# EAGLE schematic Rev2 (EAGLE 7.7.0)
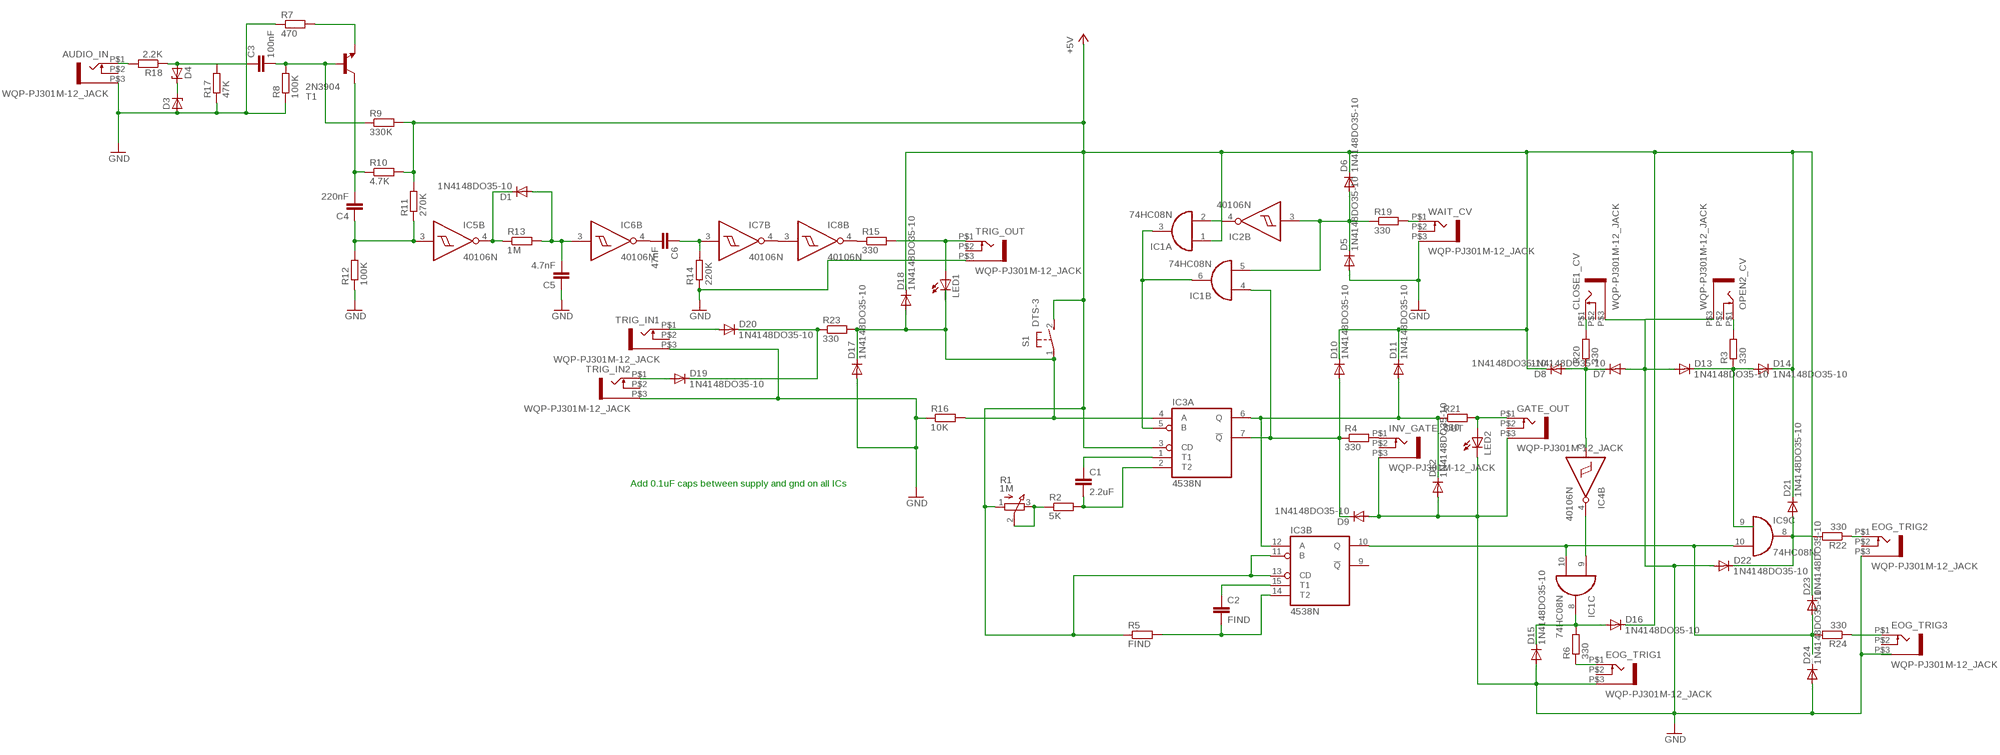
[diagram p0: schematic, sheet 1]

## Parts
AUDIO_IN  WQP-PJ301M-12_JACK  [WQP-PJ301M-12_JACK]
C1  2.2uF  C2,5-3  [C2.5-3]
C2  FIND  C2,5-3  [C2.5-3]
C3  100nF  C2,5-3  [C2.5-3]
C4  220nF  C2,5-3  [C2.5-3]
C5  4.7nF  C2,5-3  [C2.5-3]
C6  47nF  C2,5-3  [C2.5-3]
CLOSE1_CV  WQP-PJ301M-12_JACK  [WQP-PJ301M-12_JACK]
D1  1N4148DO35-10  [DO35-10]
D3  ZENER-DIODEC1702-15  [C1702-15]
D4  ZENER-DIODEC1702-15  [C1702-15]
D5  1N4148DO35-10  [DO35-10]
D6  1N4148DO35-10  [DO35-10]
D7  1N4148DO35-10  [DO35-10]
D8  1N4148DO35-10  [DO35-10]
D9  1N4148DO35-10  [DO35-10]
D10  1N4148DO35-10  [DO35-10]
D11  1N4148DO35-10  [DO35-10]
D12  1N4148DO35-10  [DO35-10]
D13  1N4148DO35-10  [DO35-10]
D14  1N4148DO35-10  [DO35-10]
D15  1N4148DO35-10  [DO35-10]
D16  1N4148DO35-10  [DO35-10]
D17  1N4148DO35-10  [DO35-10]
D18  1N4148DO35-10  [DO35-10]
D19  1N4148DO35-10  [DO35-10]
D20  1N4148DO35-10  [DO35-10]
D21  1N4148DO35-10  [DO35-10]
D22  1N4148DO35-10  [DO35-10]
D23  1N4148DO35-10  [DO35-10]
D24  1N4148DO35-10  [DO35-10]
EOG_TRIG1  WQP-PJ301M-12_JACK  [WQP-PJ301M-12_JACK]
EOG_TRIG2  WQP-PJ301M-12_JACK  [WQP-PJ301M-12_JACK]
EOG_TRIG3  WQP-PJ301M-12_JACK  [WQP-PJ301M-12_JACK]
GATE_OUT  WQP-PJ301M-12_JACK  [WQP-PJ301M-12_JACK]
IC1  74HC08N  [DIL14]
IC2  40106N  [DIL14]
IC3  4538N  [DIL16]
IC4  40106N  [DIL14]
IC5  40106N  [DIL14]
IC6  40106N  [DIL14]
IC7  40106N  [DIL14]
IC8  40106N  [DIL14]
IC9  74HC08N  [DIL14]
INV_GATE_OUT  WQP-PJ301M-12_JACK  [WQP-PJ301M-12_JACK]
LED1  LED3MM  [LED3MM]
LED2  LED3MM  [LED3MM]
OPEN2_CV  WQP-PJ301M-12_JACK  [WQP-PJ301M-12_JACK]
R1  1M  3RP/1610N  [3RP/1610N]
R2  5K  R-EU_0204/2V  [0204V]
R3  330  R-EU_0204/2V  [0204V]
R4  330  R-EU_0204/2V  [0204V]
R5  FIND  R-EU_0204/2V  [0204V]
R6  330  R-EU_0204/2V  [0204V]
R7  470  R-EU_0204/2V  [0204V]
R8  100K  R-EU_0204/2V  [0204V]
R9  330K  R-EU_0204/2V  [0204V]
R10  4.7K  R-EU_0204/2V  [0204V]
R11  270K  R-EU_0204/2V  [0204V]
R12  100K  R-EU_0204/2V  [0204V]
R13  1M  R-EU_0204/2V  [0204V]
R14  220K  R-EU_0204/2V  [0204V]
R15  330  R-EU_0204/2V  [0204V]
R16  10K  R-EU_0204/2V  [0204V]
R17  47K  R-EU_0204/2V  [0204V]
R18  2.2K  R-EU_0204/2V  [0204V]
R19  330  R-EU_0204/2V  [0204V]
R20  330  R-EU_0204/2V  [0204V]
R21  330  R-EU_0204/2V  [0204V]
R22  330  R-EU_0204/2V  [0204V]
R23  330  R-EU_0204/2V  [0204V]
R24  330  R-EU_0204/2V  [0204V]
S1  DTS-3  [DTS-3]
T1  2N3904  [TO92]
TRIG_IN1  WQP-PJ301M-12_JACK  [WQP-PJ301M-12_JACK]
TRIG_IN2  WQP-PJ301M-12_JACK  [WQP-PJ301M-12_JACK]
TRIG_OUT  WQP-PJ301M-12_JACK  [WQP-PJ301M-12_JACK]
WAIT_CV  WQP-PJ301M-12_JACK  [WQP-PJ301M-12_JACK]

## Nets
+5V: D6.C D8.C D10.C D11.C D14.C D16.C D18.C D21.C D23.C IC1.1(A:I0) IC3.3(A:CD) IC3.11(B:B) IC3.13(B:CD) R1.1(A) R5.1 R9.2 R10.2 R11.2 S1.2
GND: AUDIO_IN.P$3 C5.1 CLOSE1_CV.P$3 D3.A D5.A D7.A D9.A D12.A D13.A D15.A D17.A D22.A D24.A EOG_TRIG1.P$3 EOG_TRIG2.P$3 GATE_OUT.P$3 INV_GATE_OUT.P$3 LED2.K(C) OPEN2_CV.P$3 R7.1 R8.1 R12.1 R14.1 R16.1 R17.1 TRIG_IN1.P$3 TRIG_IN2.P$3 TRIG_OUT.P$3 WAIT_CV.P$3
N$1: C1.1 IC3.1(A:T1)
N$2: C1.2 IC3.2(A:T2) R2.2
N$3: R1.2(S) R1.3(E) R2.1
N$4: IC1.3(A:O) IC1.6(B:O) IC3.5(A:B)
N$5: D9.C D10.A IC1.4(B:I0) IC3.7(A:!Q) R4.1
N$6: D11.A D12.C IC3.6(A:Q) IC3.12(B:A) R21.1
N$7: GATE_OUT.P$1 LED2.A R21.2
N$8: IC1.10(C:I1) IC3.10(B:Q) IC9.10(C:I1) R24.2
N$9: INV_GATE_OUT.P$1 R4.2
N$10: D5.C D6.A IC1.5(B:I1) IC2.3(B:I) R19.1
N$11: IC1.2(A:I1) IC2.4(B:O)
N$12: C2.1 IC3.15(B:T1)
N$13: C2.2 IC3.14(B:T2) R5.2
N$14: CLOSE1_CV.P$1 R20.2
N$15: IC1.9(C:I0) IC4.4(B:O)
N$16: OPEN2_CV.P$1 R3.2
N$17: EOG_TRIG1.P$1 R6.1
N$18: C3.1 D4.A R17.2 R18.1
N$19: C5.2 D1.A IC6.3(B:I) R13.2
N$20: C3.2 R8.2 R9.1 T1.2(B)
N$21: R7.2 T1.3(E)
N$22: C4.2 R10.1 T1.1(C)
N$23: C4.1 IC5.3(B:I) R11.1 R12.2
N$24: C6.2 IC6.4(B:O)
N$25: D1.C IC5.4(B:O) R13.1
N$26: C6.1 IC7.3(B:I) R14.2
N$27: IC7.4(B:O) IC8.3(B:I)
N$28: IC8.4(B:O) R15.1
N$29: LED1.A R15.2 TRIG_OUT.P$1
N$30: AUDIO_IN.P$1 R18.2
N$31: D3.C D4.C
N$32: R19.2 WAIT_CV.P$1
N$33: EOG_TRIG2.P$1 R22.1
N$34: D15.C D16.A IC1.8(C:O) R6.2
N$35: D19.C D20.C R23.1
N$36: D17.C D18.A IC3.4(A:A) LED1.K(C) R16.2 R23.2 S1.1
N$37: D19.A TRIG_IN2.P$1
N$38: D20.A TRIG_IN1.P$1
N$39: D13.C D14.A IC9.9(C:I0) R3.1
N$40: D7.C D8.A IC4.3(B:I) R20.1
N$41: D21.A D22.C IC9.8(C:O) R22.2
N$42: D23.A
N$44: EOG_TRIG3.P$1 R24.1
Unconnected: AUDIO_IN.P$2 CLOSE1_CV.P$2 D24.C EOG_TRIG1.P$2 EOG_TRIG2.P$2 EOG_TRIG3.P$2 EOG_TRIG3.P$3 GATE_OUT.P$2 IC1.11(D:O) IC1.12(D:I0) IC1.13(D:I1) IC2.1(A:I) IC2.2(A:O) IC2.5(C:I) IC2.6(C:O) IC2.8(D:O) IC2.9(D:I) IC2.10(E:O) IC2.11(E:I) IC2.12(F:O) IC2.13(F:I) IC3.9(B:!Q) IC4.1(A:I) IC4.2(A:O) IC4.5(C:I) IC4.6(C:O) IC4.8(D:O) IC4.9(D:I) IC4.10(E:O) IC4.11(E:I) IC4.12(F:O) IC4.13(F:I) IC5.1(A:I) IC5.2(A:O) IC5.5(C:I) IC5.6(C:O) IC5.8(D:O) IC5.9(D:I) IC5.10(E:O) IC5.11(E:I) IC5.12(F:O) IC5.13(F:I) IC6.1(A:I) IC6.2(A:O) IC6.5(C:I) IC6.6(C:O) IC6.8(D:O) IC6.9(D:I) IC6.10(E:O) IC6.11(E:I) IC6.12(F:O) IC6.13(F:I) IC7.1(A:I) IC7.2(A:O) IC7.5(C:I) IC7.6(C:O) IC7.8(D:O) IC7.9(D:I) IC7.10(E:O) IC7.11(E:I) IC7.12(F:O) IC7.13(F:I) IC8.1(A:I) IC8.2(A:O) IC8.5(C:I) IC8.6(C:O) IC8.8(D:O) IC8.9(D:I) IC8.10(E:O) IC8.11(E:I) IC8.12(F:O) IC8.13(F:I) IC9.1(A:I0) IC9.2(A:I1) IC9.3(A:O) IC9.4(B:I0) IC9.5(B:I1) IC9.6(B:O) IC9.11(D:O) IC9.12(D:I0) IC9.13(D:I1) INV_GATE_OUT.P$2 OPEN2_CV.P$2 TRIG_IN1.P$2 TRIG_IN2.P$2 TRIG_OUT.P$2 WAIT_CV.P$2

## Notes on the sheet
- Add 0.1uF caps between supply and gnd on all ICs

## Power pins joined to a net without a drawn wire
GND: IC1.7(P:GND) IC9.7(P:GND)
VCC: IC1.14(P:VCC) IC9.14(P:VCC)
VDD: IC2.14(P:VDD) IC3.16(P:VDD) IC4.14(P:VDD) IC5.14(P:VDD) IC6.14(P:VDD) IC7.14(P:VDD) IC8.14(P:VDD)
VSS: IC2.7(P:VSS) IC3.8(P:VSS) IC4.7(P:VSS) IC5.7(P:VSS) IC6.7(P:VSS) IC7.7(P:VSS) IC8.7(P:VSS)

## Library data of the parts
AUDIO_IN CLOSE1_CV EOG_TRIG1-EOG_TRIG3 GATE_OUT INV_GATE_OUT OPEN2_CV TRIG_IN1 TRIG_IN2 TRIG_OUT WAIT_CV = thonkiconn:WQP-PJ301M-12_JACK
C1-C6 = capacitor-wima:C: CAPACITOR naming: grid - package width
D1 D5-D24 = diode:1N4148: DIODE high speed (Philips)
D3 D4 = diode:ZENER-DIODE: Z-Diode
IC1 IC9 = 74xx-eu:74*08: Quad 2-input AND gate
IC2 IC4-IC8 = 40xx:40106: Hex SCHMITT TRIGGER
IC3 = 45xx:4538: Dual precision monostable MULTIVIBRATOR
LED1 LED2 = led:LED: LED OSRAM: - CHIPLED LG R971, LG N971, LY N971, LG Q971, LY Q971, LO R971, LY R971 LH N974, LH R974 LS Q976, LO Q976, LY Q976 LO Q996 - Hyper CHIPLED LW Q18S LB Q993, LB Q99A, LB R99A - SideLED LS A670, LO A670, LY A670, LG A670, LP A670 LB A673, LV A673, LT A673, LW A673 LH A674 LY A675 LS A676, LA A676, LO A676, LY A676, LW A676 LS A679, LY A679, LG A679 - Hyper Micro SIDELED® LS Y876, LA Y876, LO Y876, LY Y876 LT Y87S - SmartLED LW L88C, LW L88S LB L89C, LB L89S, LG L890 LS L89K, LO L89K, LY L89K LS L896, LA L896, LO L896, LY L896 - TOPLED LS T670, LO T670, LY T670, LG T670, LP T670 LSG T670, LSP T670, LSY T670, LOP T670, LYG T670 LG T671, LOG T671, LSG T671 LB T673, LV T673, LT T673, LW T673 LH T674 LS T676, LA T676, LO T676, LY T676, LB T676, LH T676, LSB T676, LW T676 LB T67C, LV T67C, LT T67C, LS T67K, LO T67K, LY T67K, LW E67C LS E67B, LA E67B, LO E67B, LY E67B, LB E67C, LV E67C, LT E67C LW T67C LS T679, LY T679, LG T679 LS T770, LO T770, LY T770, LG T770, LP T770 LB T773, LV T773, LT T773, LW T773 LH T774 LS E675, LA E675, LY E675, LS T675 LS T776, LA T776, LO T776, LY T776, LB T776 LHGB T686 LT T68C, LB T68C - Hyper Mini TOPLED® LB M676 - Mini TOPLED Santana® LG M470 LS M47K, LO M47K, LY M47K Source: http://www.osram.convergy.de LUXEON: - LUMILED® LXK2-PW12-R00, LXK2-PW12-S00, LXK2-PW14-U00, LXK2-PW14-V00 LXK2-PM12-R00, LXK2-PM12-S00, LXK2-PM14-U00 LXK2-PE12-Q00, LXK2-PE12-R00, LXK2-PE12-S00, LXK2-PE14-T00, LXK2-PE14-U00 LXK2-PB12-K00, LXK2-PB12-L00, LXK2-PB12-M00, LXK2-PB14-N00, LXK2-PB14-P00, LXK2-PB14-Q00 LXK2-PR12-L00, LXK2-PR12-M00, LXK2-PR14-Q00, LXK2-PR14-R00 LXK2-PD12-Q00, LXK2-PD12-R00, LXK2-PD12-S00 LXK2-PH12-R00, LXK2-PH12-S00 LXK2-PL12-P00, LXK2-PL12-Q00, LXK2-PL12-R00 Source: www.luxeon.com KINGBRIGHT: KA-3528ASYC Source: www.kingbright.com
R1 = pot:3RP/1610N: 16mm Potentiometer one level Source: http://www.alphapotentiometers.net/html/16mm_pot_2.html
R2-R24 = resistor:R-EU_: RESISTOR, European symbol
S1 = switch-tact:DTS-3
T1 = transistor:2N3904: NPN TRANSISTOR